# EAGLE design iv4_4lw_1.2.2_dev (EAGLE 5.07)
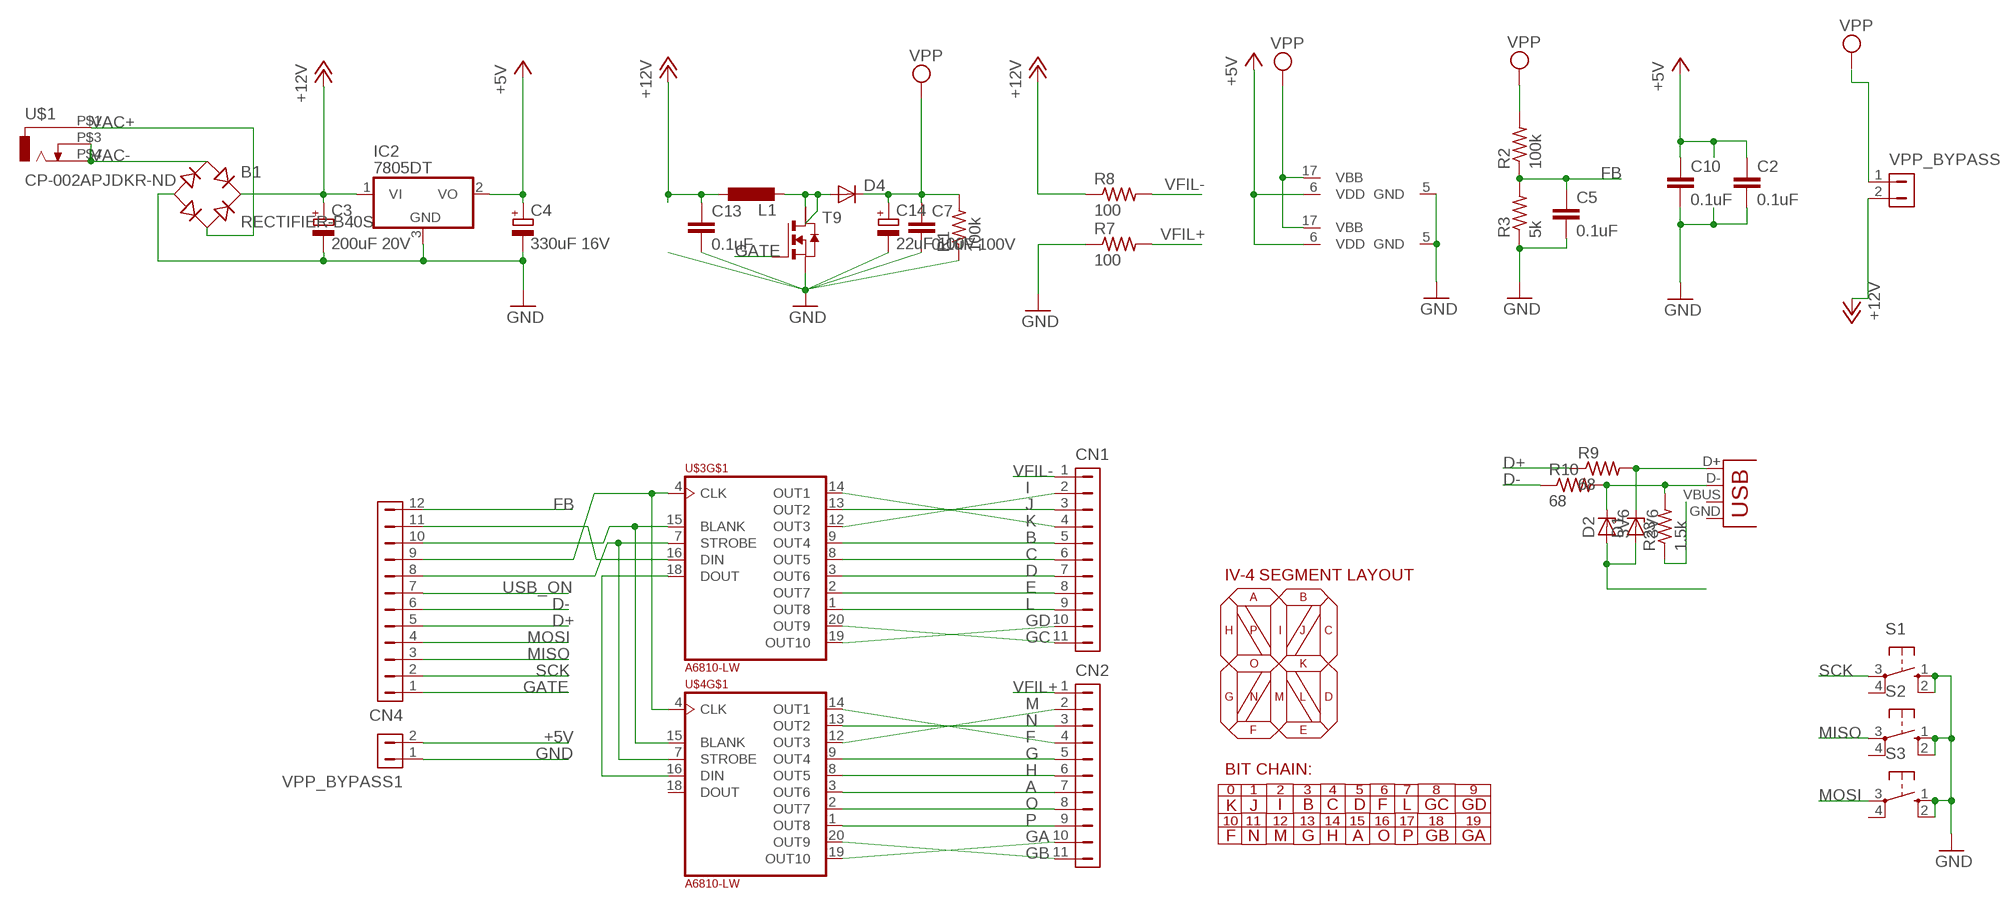
[diagram p0: schematic, sheet 1]

## Parts
B1  RECTIFIER-B40S  [B40S]
C2  0.1uF  C-EUC0805  [C0805]
C3  200uF 20V  CPOL-EUUD-8X10  [UD-8X10_NICHICON]
C4  330uF 16V  CPOL-EUUD-8X10  [UD-8X10_NICHICON]
C5  0.1uF  C-EUC0805  [C0805]
C7  0.1uF 100V  C-EUC1206  [C1206]
C10  0.1uF  C-EUC0805  [C0805]
C13  0.1uF  C-EUC0805  [C0805]
C14  22uF 100V  CPOL-EUUD-8X10  [UD-8X10_NICHICON]
CN1  HDR-1X11-SIP-100  [SIP-100-11V]
CN2  HDR-1X11-SIP-100  [SIP-100-11V]
CN4  HDR-1X12-SIP-100  [SIP-100-12V]
D1  3V6  ZENER-DIODESOD80C  [SOD80C]
D2  3V6  ZENER-DIODESOD80C  [SOD80C]
D4  DIODE-DO214AC  [DO214AC]
IC2  7805DT  [TO252]
L1  DO3316P  [DO3316P]
R1  100k  R-US_R0805  [R0805]
R2  100k  R-US_R0805  [R0805]
R3  5k  R-US_R0805  [R0805]
R7  100  R-US_0207/7  [0207/7]
R8  100  R-US_0207/7  [0207/7]
R9  68  R-US_R0805  [R0805]
R10  68  R-US_R0805  [R0805]
R23  1.5k  R-US_R0805  [R0805]
S1  10-XX  [B3F-10XX]
S2  10-XX  [B3F-10XX]
S3  10-XX  [B3F-10XX]
T9  NMOSSOT223  [SOT223]
U$1  CP-002APJDKR-ND  PJ002A-SMT  [PJ002A-SMT]
U$3  A6810-LW  [SO20W]
U$4  A6810-LW  [SO20W]
VPP_BYPASS  HDR-1X2-SIP-100  [SIP-100-2V]
VPP_BYPASS1  HDR-1X2-SIP-100  [SIP-100-2V]
X1  USBSMD  [USB-MINIB]

## Nets
+5V: C2.1 C4.+ C10.1 IC2.2(VO) U$3.6(VDD) U$4.6(VDD) VPP_BYPASS1.2
+12V: B1.+ C3.+ C13.1 IC2.1(VI) L1.2 R8.1 VPP_BYPASS.2
A: CN2.7 U$4.3(OUT6)
B: CN1.5 U$3.9(OUT4)
BLANK: CN4.10 U$3.15(BLANK) U$4.15(BLANK)
C: CN1.6 U$3.8(OUT5)
CLK: CN4.9 U$3.4(CLK) U$4.4(CLK)
D: CN1.7 U$3.3(OUT6)
D+: CN4.5 R9.1
D-: CN4.6 R10.1
DIN: CN4.11 U$3.16(DIN)
DIN1: U$3.18(DOUT) U$4.16(DIN)
E: CN1.8 U$3.2(OUT7)
F: CN2.4 U$4.14(OUT1)
FB: C5.1 CN4.12 R2.1 R3.2
G: CN2.5 U$4.9(OUT4)
GA: CN2.10 U$4.19(OUT10)
GATE: CN4.1 T9.1(G)
GB: CN2.11 U$4.20(OUT9)
GC: CN1.11 U$3.20(OUT9)
GD: CN1.10 U$3.19(OUT10)
GND: B1.- C2.2 C3.- C4.- C5.2 C7.2 C10.2 C13.2 C14.- D1.A D2.A IC2.3(GND) R1.1 R3.1 R7.1 S1.1(S) S1.2(S1) S2.1(S) S2.2(S1) S3.1(S) S3.2(S1) T9.3(S) U$3.5(GND) U$4.5(GND) VPP_BYPASS1.1
H: CN2.6 U$4.8(OUT5)
I: CN1.2 U$3.12(OUT3)
J: CN1.3 U$3.13(OUT2)
K: CN1.4 U$3.14(OUT1)
L: CN1.9 U$3.1(OUT8)
M: CN2.2 U$4.12(OUT3)
MISO: CN4.3 S2.3(P)
MOSI: CN4.4 S3.3(P)
N: CN2.3 U$4.13(OUT2)
N$1: D4.A L1.1 T9.2(D) T9.4(D2)
N$4: D2.C R10.2 R23.2 X1.D-
N$5: D1.C R9.2 X1.D+
O: CN2.8 U$4.2(OUT7)
P: CN2.9 U$4.1(OUT8)
SCK: CN4.2 S1.3(P)
STROBE: CN4.8 U$3.7(STROBE) U$4.7(STROBE)
USB_ON: CN4.7 R23.1
VAC+: B1.AC2 U$1.P$1
VAC-: B1.AC1 U$1.P$3 U$1.P$4
VFIL+: CN2.1 R7.2
VFIL-: CN1.1 R8.2
VPP: C7.1 C14.+ D4.C R1.2 R2.2 U$3.17(VBB) U$4.17(VBB) VPP_BYPASS.1
Unconnected: S1.4(P1) S2.4(P1) S3.4(P1) U$4.18(DOUT) X1.GND X1.VBUS

## Notes on the sheet
- IV-4 SEGMENT LAYOUT
- A | B
- H | P | I | J | C
- O | K
- G | N | M | L | D
- F | E
- BIT CHAIN:
- 0 | 1 | 2 | 3 | 4 | 5 | 6 | 7 | 8 | 9
- K | J | I | B | C | D | F | L | GC | GD
- 10 | 11 | 12 | 13 | 14 | 15 | 16 | 17 | 18 | 19
- F | N | M | G | H | A | O | P | GB | GA

## Library data of the parts
B1 = rectifier:RECTIFIER-: Rectifier
C2 C5 C7 C10 C13 = rcl:C-EU: CAPACITOR, European symbol
C3 C4 C14 = rcl:CPOL-EU: POLARIZED CAPACITOR, European symbol
CN1 CN2 = con-hdrs40:HDR-1X11: HEADER CONNECTOR
CN4 = con-hdrs40:HDR-1X12: HEADER CONNECTOR
D1 D2 = diode:ZENER-DIODE: Z-Diode
D4 = diode:DIODE-: DIODE
IC2 = linear:78*: Positive VOLTAGE REGULATOR Source: http://cache.national.com/ds/LM/LM78L05.pdf http://www.fairchildsemi.com/ds/LM/LM7805.pdf
L1 = inductor-coilcraft:DO3316P: COILCRAFT
R1-R3 R7-R10 R23 = rcl:R-US_: RESISTOR, American symbol
S1-S3 = switch-omron:10-XX: OMRON SWITCH
T9 = zetex:NMOSSOT223: MOS FET
U$1 = con-jack:PJ002A-SMT
U$3 U$4 = allegro:A6810-LW
VPP_BYPASS VPP_BYPASS1 = con-hdrs40:HDR-1X2: HEADER CONNECTOR
X1 = SparkFun:USB: USB Connectors USB-B-PTH is fully proven SKU : PRT-00139 USB-miniB is fully proven SKU : PRT-00587 USB-A-PCB is untested. USB-A-H is throughly reviewed, but untested. Spark Fun Electronics SKU : PRT-00437 USB-B-SMT is throughly reviewed, but untested. Needs silkscreen touching up. USB-A-S has not been used/tested USB-MB-H has not been used/tested

## Board
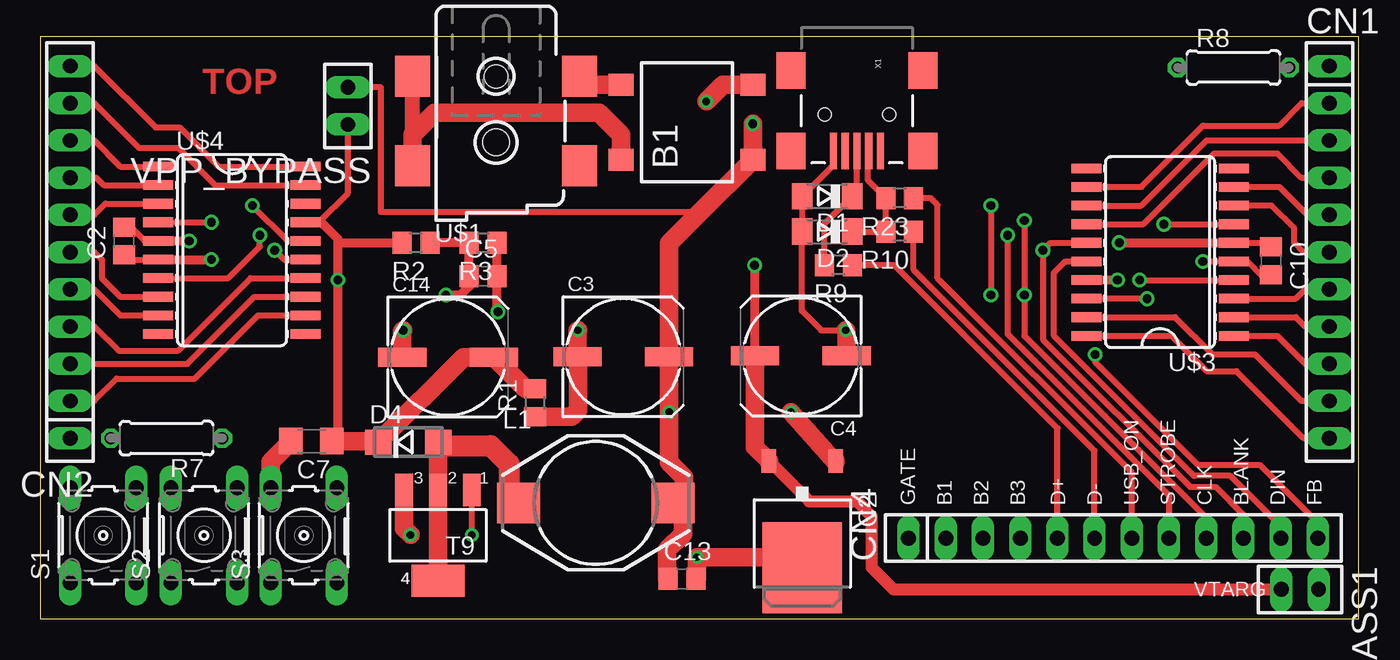
[diagram p1: board, top side]
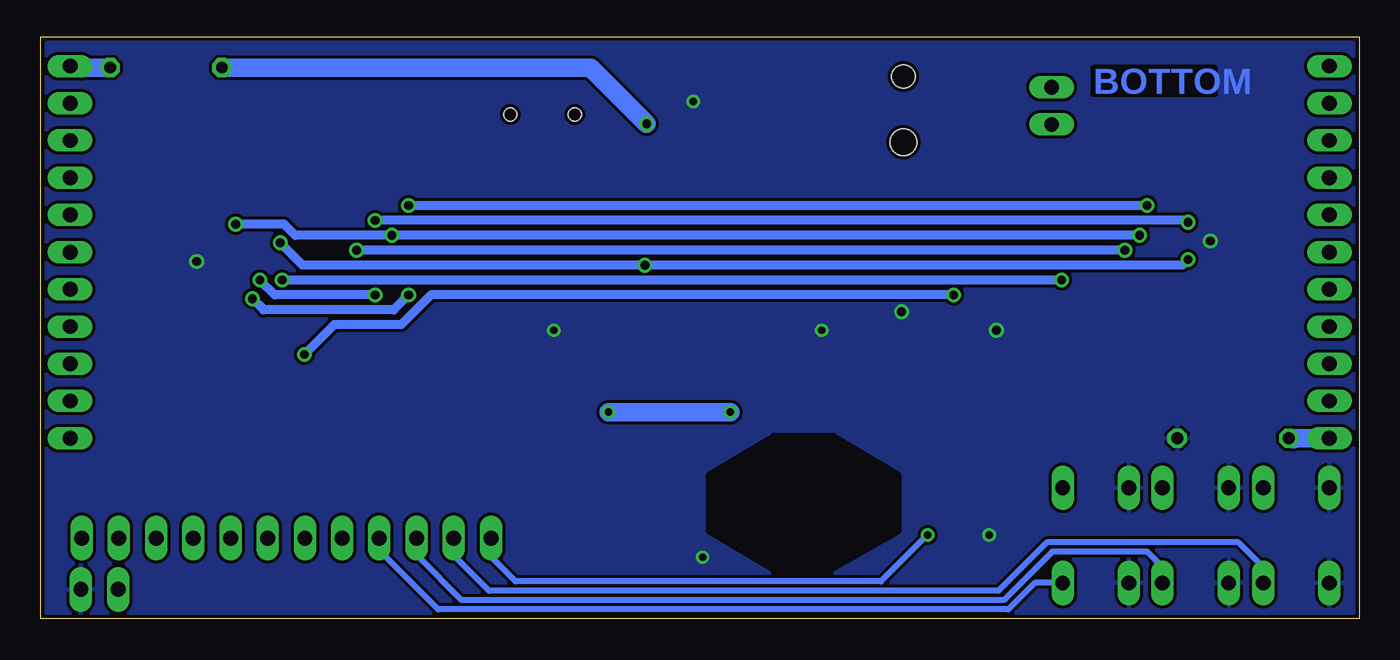
[diagram p2: board, bottom side, seen from below]

Size 90.02 x 39.73 mm. Coordinates in mm from the lower left corner, seen from the top.
Outline: 0,0 90.02,0 90.02,39.73 0,39.73 0,0
Copper layers (1*16): Top 0.035mm / dielectric 1.5mm / Bottom 0.035mm
Design rules "default *": minimum track width 8mil, minimum drill 20mil, track to track 8mil, track to pad 8mil, pad to pad 8mil, via to via 8mil, smd to smd 8mil, copper to edge 10mil, drill to drill 8mil, minimum pad ring 10mil, minimum via ring 8mil, stop-mask expansion 4mil, vias tented up to drill 0mil, thermal gap 8mil
bRestrict: area 31.5,3.3 to 44.4,12.5

### Footprints (pad centres in the part's own frame; a part is rotated, then mirrored left to right if it is on the bottom)
B40S = smd 1.5 x 1.7: + -2.55,-4.5; - 2.55,-4.5; AC1 -2.55,4.5; AC2 2.55,4.5
C0805 = smd 1.3 x 1.5: 1 -0.95,0; 2 0.95,0
UD-8X10_NICHICON = smd 3.3 x 1.3: + 3.125,0; - -3.125,0
C1206 = smd 1.6 x 1.8: 1 -1.4,0; 2 1.4,0
SIP-100-11V = drill 1.016 long: 1 -12.7,0; 2 -10.16,0; 3 -7.62,0; 4 -5.08,0; 5 -2.54,0; 6 0,0; 7 2.54,0; 8 5.08,0; 9 7.62,0; 10 10.16,0; 11 12.7,0
SIP-100-12V = drill 1.016 long: 1 -13.97,0; 2 -11.43,0; 3 -8.89,0; 4 -6.35,0; 5 -3.81,0; 6 -1.27,0; 7 1.27,0; 8 3.81,0; 9 6.35,0; 10 8.89,0; 11 11.43,0; 12 13.97,0
SOD80C = smd 1.4 x 1.8: A 1.7,0; C -1.7,0
DO214AC = smd 1.8 x 1.7: A 2.05,0; C -2.05,0
TO252 = smd 1 x 1.6: 1 -2.28,-4.8; 2 2.28,-4.8 | smd 5.4 x 6.2: 3 0,2.5
DO3316P = smd 2.92 x 2.79: 1 -5.28,0; 2 5.28,0
R0805 = smd 1.3 x 1.5: 1 -0.95,0; 2 0.95,0
0207/7 = drill 0.813 octagon: 1 -3.81,0; 2 3.81,0
B3F-10XX = drill 1.016 long: 1 -3.251,2.261; 2 3.251,2.261; 3 -3.251,-2.261; 4 3.251,-2.261
SOT223 = smd 1.219 x 2.235: 1 -2.311,-3.099; 2 0,-3.099; 3 2.311,-3.099 | smd 3.6 x 2.2: 4 0,3.099
PJ002A-SMT = smd 2.4 x 2.8: P$1 5.7,6.4; P$2 5.7,0.3; P$3 -5.7,6.4; P$4 -5.7,0.3 | hole 1.6: 0,6.4 | hole 1.8: 0,1.9
SO20W = smd 0.66 x 2.032: 1 -5.715,-5.029; 2 -4.445,-5.029; 3 -3.175,-5.029; 4 -1.905,-5.029; 5 -0.635,-5.029; 6 0.635,-5.029; 7 1.905,-5.029; 8 3.175,-5.029; 9 4.445,-5.029; 10 5.715,-5.029; 11 5.715,5.029; 12 4.445,5.029; 13 3.175,5.029; 14 1.905,5.029; 15 0.635,5.029; 16 -0.635,5.029; 17 -1.905,5.029; 18 -3.175,5.029; 19 -4.445,5.029; 20 -5.715,5.029
SIP-100-2V = drill 1.016 long: 1 -1.27,0; 2 1.27,0
USB-MINIB = smd 2.5 x 0.5: D+ 2.5,0; D- 2.5,0.8; GND 2.5,-1.6; ID 2.5,-0.8; VBUS 2.5,1.6 | smd 2.5 x 2: GND@1 -3,-4.5; GND@2 -3,4.5; GND@3 2.5,4.5; GND@4 2.5,-4.5 | hole 0.9: 0,2.2; 0,-2.2

### Placement (x,y rotation side)
B1  44.15,33.88 90 top
C2  5.72,25.78 90 top
C3  39.8,17.88 0 top
C4  51.92,17.93 180 top
C5  30.23,23.37 0 top
C7  18.52,12.12 180 top
C10  84.02,24.44 270 top
C13  43.82,2.72 0 top
C14  27.84,17.86 0 top
CN1  88.01,25.02 270 top
CN2  2.03,25.02 90 top
CN4  73.25,5.5 0 top
D1  53.72,28.83 180 top
D2  53.72,26.42 180 top
D4  25.12,12.04 0 top
IC2  52.02,5.97 180 top
L1  37.92,7.9 0 top
R1  33.78,14.73 90 top
R2  25.65,25.65 180 top
R3  30.23,25.65 180 top
R7  8.61,12.32 180 top
R8  81.46,37.62 0 top
R9  54.48,24.13 180 top
R10  58.67,26.42 180 top
R23  58.67,28.7 180 top
S1  4.29,5.69 90 top
S2  11.18,5.69 90 top
S3  17.98,5.69 90 top
T9  27.15,5.69 180 top
U$1  31.12,30.61 0 top
U$3  76.45,25.02 90 top
U$4  13.08,25.15 270 top
VPP_BYPASS  21,35 90 top
VPP_BYPASS1  86,2 180 top
X1  55.75,34.42 270 top

### Tracks (layer width: path | path; a pad name or v marks a point on that pad's centre or on a via)
+5V  (via drill 0.6)
  Top 0.406: C2.1 5.65,24.51 U$4.6 | U$3.6 82.04,25.65 83.78,25.65 C10.1
  Top 0.61: U$4.6 v11.68,24.51 | v73.66,25.65 82.04,25.65 | v48.77,24.13 48.77,17.96 C4.+
  Top 0.813: VPP_BYPASS1.2 58.25,2 56.75,3.5 56.75,7 55.75,8 52.51,8 IC2.2
  Top 1.27: 49.74,10.71 IC2.2 48.79,11.72 C4.+
  Bottom 0.61: v11.68,24.51 12.07,24.13 v48.77,24.13 72.14,24.13 v73.66,25.65
+12V  (via drill 0.51, 0.6)
  Top 0.406: VPP_BYPASS.2 23.25,36.27 23.25,27.75 44.91,27.75 44.91,27.59
  Top 1.27: L1.2 43.88,7.9 43.88,7.37 | 43.88,7.37 43.88,5.78 42.8,4.7 42.8,2.72 C13.1 | 42.93,17.27 v42.93,14.1 42.93,10.67 43.94,9.65 43.94,7.43 43.88,7.37 | 42.93,17.27 C3.+ | IC2.1 54.3,10.67 v51.25,14.1 | 42.93,17.27 42.93,25.61 44.91,27.59 B1.+ v48.64,33.78
  Bottom 0.406: v48.64,33.78 48.42,34
  Bottom 1.27: v42.93,14.1 v51.25,14.1 | R8.1 52.48,37.62 v48.64,33.78
A
  Top 0.406: U$4.3 4.45,28.32 3.68,27.56 CN2.7
B
  Top 0.406: U$3.9 84.58,29.46 86.49,27.56 CN1.5
BLANK  (via drill 0.6)
  Top 0.406: U$4.15 16.64,24.51 v16,25.15 | U$3.15 68.96,25.65 v68.45,25.15 68.45,19.05 78.5,9 80.25,9 82.14,7.11 CN4.10
  Bottom 0.61: v16,25.15 v68.45,25.15
C
  Top 0.406: U$3.8 84.07,28.19 85.6,26.67 85.6,25.65 86.23,25.02 CN1.6
CLK  (via drill 0.6)
  Top 0.406: v75.06,23.11 U$3.4 | v67.18,27.18 v67.18,22.1 67.18,19.3 79.6,6.89 CN4.9 | U$4.4 v11.68,27.05
  Bottom 0.61: v67.18,22.1 74.04,22.1 v75.06,23.11 | v67.18,27.18 11.81,27.18 v11.68,27.05
D
  Top 0.406: U$3.3 85.73,21.84 86.36,22.48 CN1.7
D+
  Top 0.406: R9.1 58.31,24.13 69.44,13 CN4.5
D-
  Top 0.406: R10.1 59.62,23.83 71.98,11.48 CN4.6
DIN
  Top 0.406: U$3.16 69.98,24.38 69.22,23.62 69.22,19.3 78.77,9.75 81.25,9.75 84.68,6.32 CN4.11
DIN1  (via drill 0.6)
  Top 0.406: U$4.16 16.89,25.78 v14.48,28.19 | v64.9,28.19 v64.9,22.1 | v75.57,21.84 U$3.18
  Bottom 0.61: v14.48,28.19 v64.9,28.19 | v64.9,22.1 65.91,21.08 74.8,21.08 v75.57,21.84
E
  Top 0.406: U$3.2 85.73,20.57 86.36,19.94 CN1.8
F
  Top 0.406: U$4.14 14.35,23.24 9.4,18.29 5.33,18.29 3.68,19.94 CN2.4
FB  (via drill 0.6)
  Top 0.406: v72.01,18.03 72.01,17.53 79.04,10.5 83.25,10.5 87.25,6.5 87.25,5.53 CN4.12
  Top 0.61: R2.1 R3.2 C5.1 29.28,22.67 28.7,22.1 v27.69,22.1
  Bottom 0.61: v27.69,22.1 63.37,22.1 65.41,20.07 69.98,20.07 v72.01,18.03
G
  Top 0.406: U$4.9 5.46,20.7 3.68,22.48 CN2.5
GA
  Top 0.406: U$4.19 11.94,29.59 9.4,32.13 6.73,32.13 3.68,35.18 CN2.10
GATE  (via drill 0.51)
  Top 0.406: v29.46,5.72 T9.1
  Bottom 0.406: v29.46,5.72 32.64,2.54 57.6,2.54 59.28,4.22 CN4.1
GB
  Top 0.406: U$4.20 12.19,30.86 9.53,33.53 7.87,33.53 3.68,37.72 CN2.11
GC
  Top 0.406: U$3.20 77.22,19.3 79.63,16.89 81.66,16.89 86.23,12.32 CN1.11
GD
  Top 0.406: U$3.19 77.47,20.57 80.01,18.03 82.93,18.03 86.11,14.86 CN1.10
GND  (via drill 0.51, 0.6)
  Top 0.406: v79.38,24.38 U$3.5 82.42,24.38 83.44,23.37 83.91,23.37 C10.2 | U$4.5 7.11,25.78 6.22,26.67 5.78,26.67 C2.2 | 54.15,30.96 D1.A D2.A 52,26.42 52,21 53.32,19.69 v54.99,19.69
  Top 0.61: U$4.5 v10.16,25.78 | R3.1 C5.2 31.18,21.02 v31.24,20.96
  Top 1.27: T9.3 24.84,6.15 v25.27,5.72 | v36.7,19.69 36.68,19.66 C3.- 36.7,17.86 36.7,14.22 36.26,13.78 R1.1 | C13.2 44.83,2.72 v44.83,4.19 52.02,4.19 IC2.3 | C4.- 55.04,19.43 v54.99,19.69 | B1.- 46.59,36.43 v45.47,35.31 | C14.- 24.71,19.63 v24.77,19.69 | C7.2 15.72,10.72 S3.2
  pour Bottom: 89.61,0.41 0.41,0.41 0.41,39.32 89.61,39.32
H
  Top 0.406: U$4.8 5.46,21.97 4.19,23.24 4.19,24.51 3.68,25.02 CN2.6
I
  Top 0.406: U$3.12 75.18,29.46 79.38,33.66 84.58,33.66 86.11,35.18 CN1.2
J
  Top 0.406: U$3.13 75.18,28.19 79.63,32.64 CN1.3
K
  Top 0.406: U$3.14 75.31,26.92 80.14,31.75 84.46,31.75 86.11,30.1 CN1.4
L
  Top 0.406: U$3.1 84.46,19.3 86.36,17.4 CN1.9
M
  Top 0.406: U$4.12 14.86,20.7 10.54,16.38 5.21,16.38 3.68,14.86 CN2.2
MISO
  Bottom 0.406: S2.3 13.44,3.53 14.48,4.57 20.96,4.57 24.26,1.27 61.27,1.27 64.25,4.25 64.25,5.39 CN4.3
MOSI
  Bottom 0.406: S3.3 22.15,2.44 23.95,0.64 62.89,0.64 66.75,4.5 66.75,5.35 CN4.4
N
  Top 0.406: U$4.13 14.61,21.97 10.03,17.4 CN2.3
N$1
  Top 1.27: T9.4 T9.2 D4.A 27.15,11.91 | 32,7.24 32.64,7.88 L1.1
  Top 1.422: 32,7.24 32,10.54 30.73,11.81 27.16,11.81 D4.A
N$4
  Top 0.406: X1.D- 56.52,31.88 56.52,29.91 R23.2 | R23.2 57.72,29.02 | R23.2 R10.2 D2.C
N$5
  Top 0.406: D1.C 55.42,29.42 | R9.2 53.53,26.94 D1.C | X1.D+ 55.75,29.16 D1.C
O
  Top 0.406: U$4.2 4.32,29.59 3.81,30.1 CN2.8
P
  Top 0.406: U$4.1 5.46,30.86 3.68,32.64 CN2.9
SCK
  Bottom 0.406: S1.3 6.55,3.51 8.26,5.21 21.34,5.21 24.64,1.91 59.41,1.91 61.75,4.25 61.75,5.43 CN4.2
STROBE  (via drill 0.6)
  Top 0.406: v66.04,26.16 66.04,19.43 77.06,8.41 CN4.8 | v76.71,26.92 U$3.7 | v14.99,26.16 14.99,25.4 12.83,23.24 U$4.7
  Bottom 0.61: v76.71,26.92 73.41,26.92 72.64,26.16 v66.04,26.16 v14.99,26.16
USB_ON
  Top 0.406: R23.1 60.8,28.7 61.25,28.25 61.25,23.25 74.52,9.98 CN4.7
VAC+
  Top 1.27: B1.AC2 37.39,36.43 U$1.P$1
VAC-
  Top 1.016: U$1.P$3 25.4,32.5
  Top 1.27: B1.AC1 39.65,33.04 38.14,34.54 26.92,34.54 25.4,33.02 25.4,32.5 25.4,30.92 U$1.P$4
VFIL+
  Bottom 1.27: 4.5,12.24 R7.2 CN2.1
VFIL-
  Bottom 1.016: R8.2 85.42,37.64
  Bottom 1.27: R8.2 88.01,37.62 CN1.1
VPP  (via drill 0.6)
  Top 0.406: D4.C 23.11,12.01 | VPP_BYPASS.1 21,29.05 19,27.05
  Top 0.61: 29.34,17.86 29.08,18.11 | U$4.17 19,27.05 19.18,27.05 20.32,25.91 20.32,25.53 | 20.32,25.53 v20.32,23.11 20.32,12.52 C7.1 | v73.53,23.11 U$3.17 | R2.2 20.45,25.65 20.32,25.53
  Top 1.27: C7.1 22.99,12.12 D4.C 28.89,17.86 29.34,17.86 C14.+ 33.14,15.68 R1.2
  Bottom 0.61: v20.32,23.11 v73.53,23.11

### Text on the board
Top: TOP
Bottom: BOTTOM
_tplace: GATE | B1 | B2 | B3 | D+ | D- | USB_ON | STROBE | CLK | BLANK | DIN | FB | 4 | VTARG